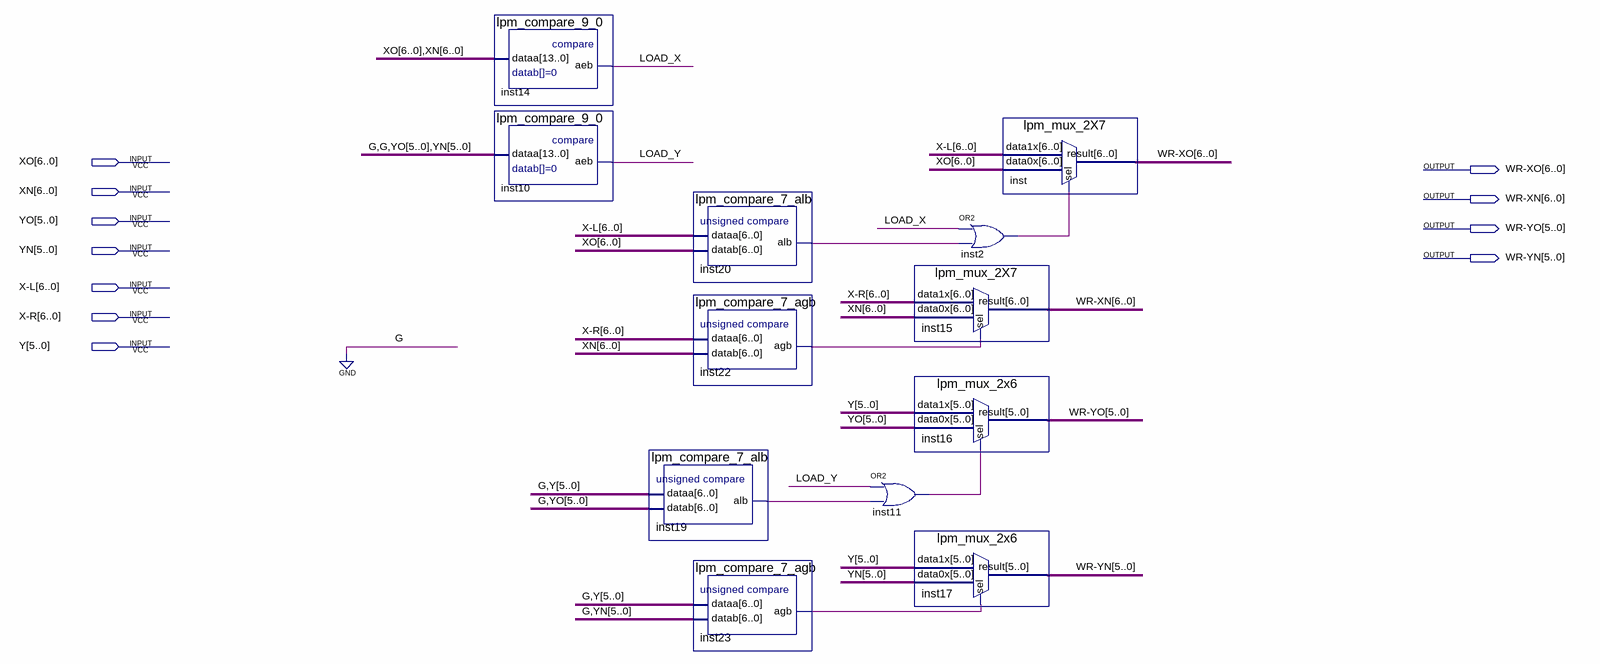
[diagram p0: schematic sheet]
// Quartus schematic expansion_H.bdf as structural Verilog: 12 symbols, 11 pins
module expansion_H (
  input  [6:0] XO,
  input  [6:0] XN,
  input  [5:0] YO,
  input  [5:0] YN,
  input  [6:0] \X-L ,
  input  [6:0] \X-R ,
  input  [5:0] Y,
  output [6:0] \WR-XO ,
  output [6:0] \WR-XN ,
  output [5:0] \WR-YO ,
  output [5:0] \WR-YN 
);

  wire inst2_out, inst11_out, inst19_alb, inst20_alb, inst22_agb, inst23_agb, LOAD_X, LOAD_Y;

  lpm_compare_9_0 inst14 (.dataa({XO, XN}), .aeb(LOAD_X));
  lpm_compare_9_0 inst10 (.dataa({2'b00, YO, YN}), .aeb(LOAD_Y));
  lpm_compare_7_alb inst19 (.dataa({1'b0, Y}), .datab({1'b0, YO}), .alb(inst19_alb));
  lpm_compare_7_alb inst20 (.dataa(\X-L ), .datab(XO), .alb(inst20_alb));
  lpm_compare_7_agb inst22 (.dataa(\X-R ), .datab(XN), .agb(inst22_agb));
  lpm_compare_7_agb inst23 (.dataa({1'b0, Y}), .datab({1'b0, YN}), .agb(inst23_agb));
  or inst11 (inst11_out, LOAD_Y, inst19_alb);
  or inst2 (inst2_out, LOAD_X, inst20_alb);
  lpm_mux_2X7 inst15 (.data1x(\X-R ), .data0x(XN), .sel(inst22_agb), .result(\WR-XN ));
  lpm_mux_2x6 inst16 (.data1x(Y), .data0x(YO), .sel(inst11_out), .result(\WR-YO ));
  lpm_mux_2x6 inst17 (.data1x(Y), .data0x(YN), .sel(inst23_agb), .result(\WR-YN ));
  lpm_mux_2X7 inst (.data1x(\X-L ), .data0x(XO), .sel(inst2_out), .result(\WR-XO ));
endmodule
